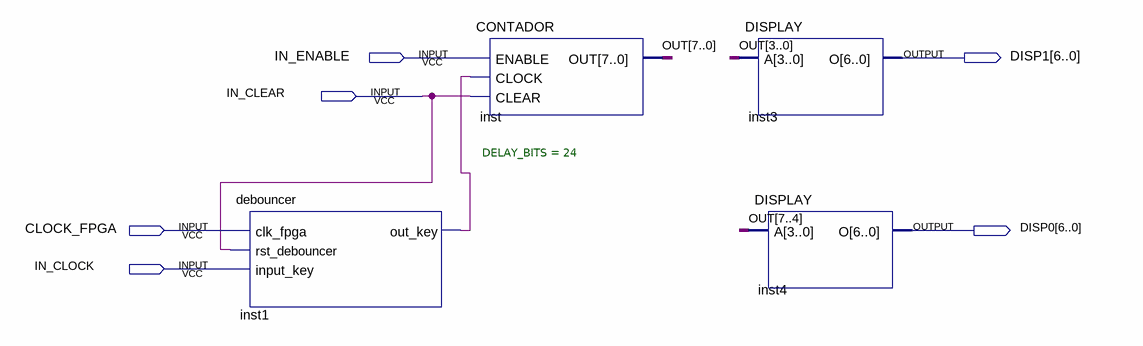
[diagram p0: schematic sheet]
// Quartus schematic TESTE_CONTADOR.bdf as structural Verilog: 4 symbols, 6 pins
module TESTE_CONTADOR (
  input  IN_ENABLE,
  input  IN_CLEAR,
  input  CLOCK_FPGA,
  input  IN_CLOCK,
  output [6:0] DISP1,
  output [6:0] DISP0
);

  wire inst1_out_key;
  wire [7:0] OUT;

  debouncer #(.DELAY_BITS(24)) inst1 (
    .clk_fpga(CLOCK_FPGA), .rst_debouncer(IN_CLEAR), .input_key(IN_CLOCK), .out_key(inst1_out_key));
  CONTADOR inst (.ENABLE(IN_ENABLE), .CLOCK(inst1_out_key), .CLEAR(IN_CLEAR), .OUT(OUT));
  DISPLAY inst3 (.A(OUT[3:0]), .O(DISP1));
  DISPLAY inst4 (.A(OUT[7:4]), .O(DISP0));
endmodule
